# EAGLE design tricorder-sensors-mk-1.2-no-tabs (EAGLE 7.5.0)
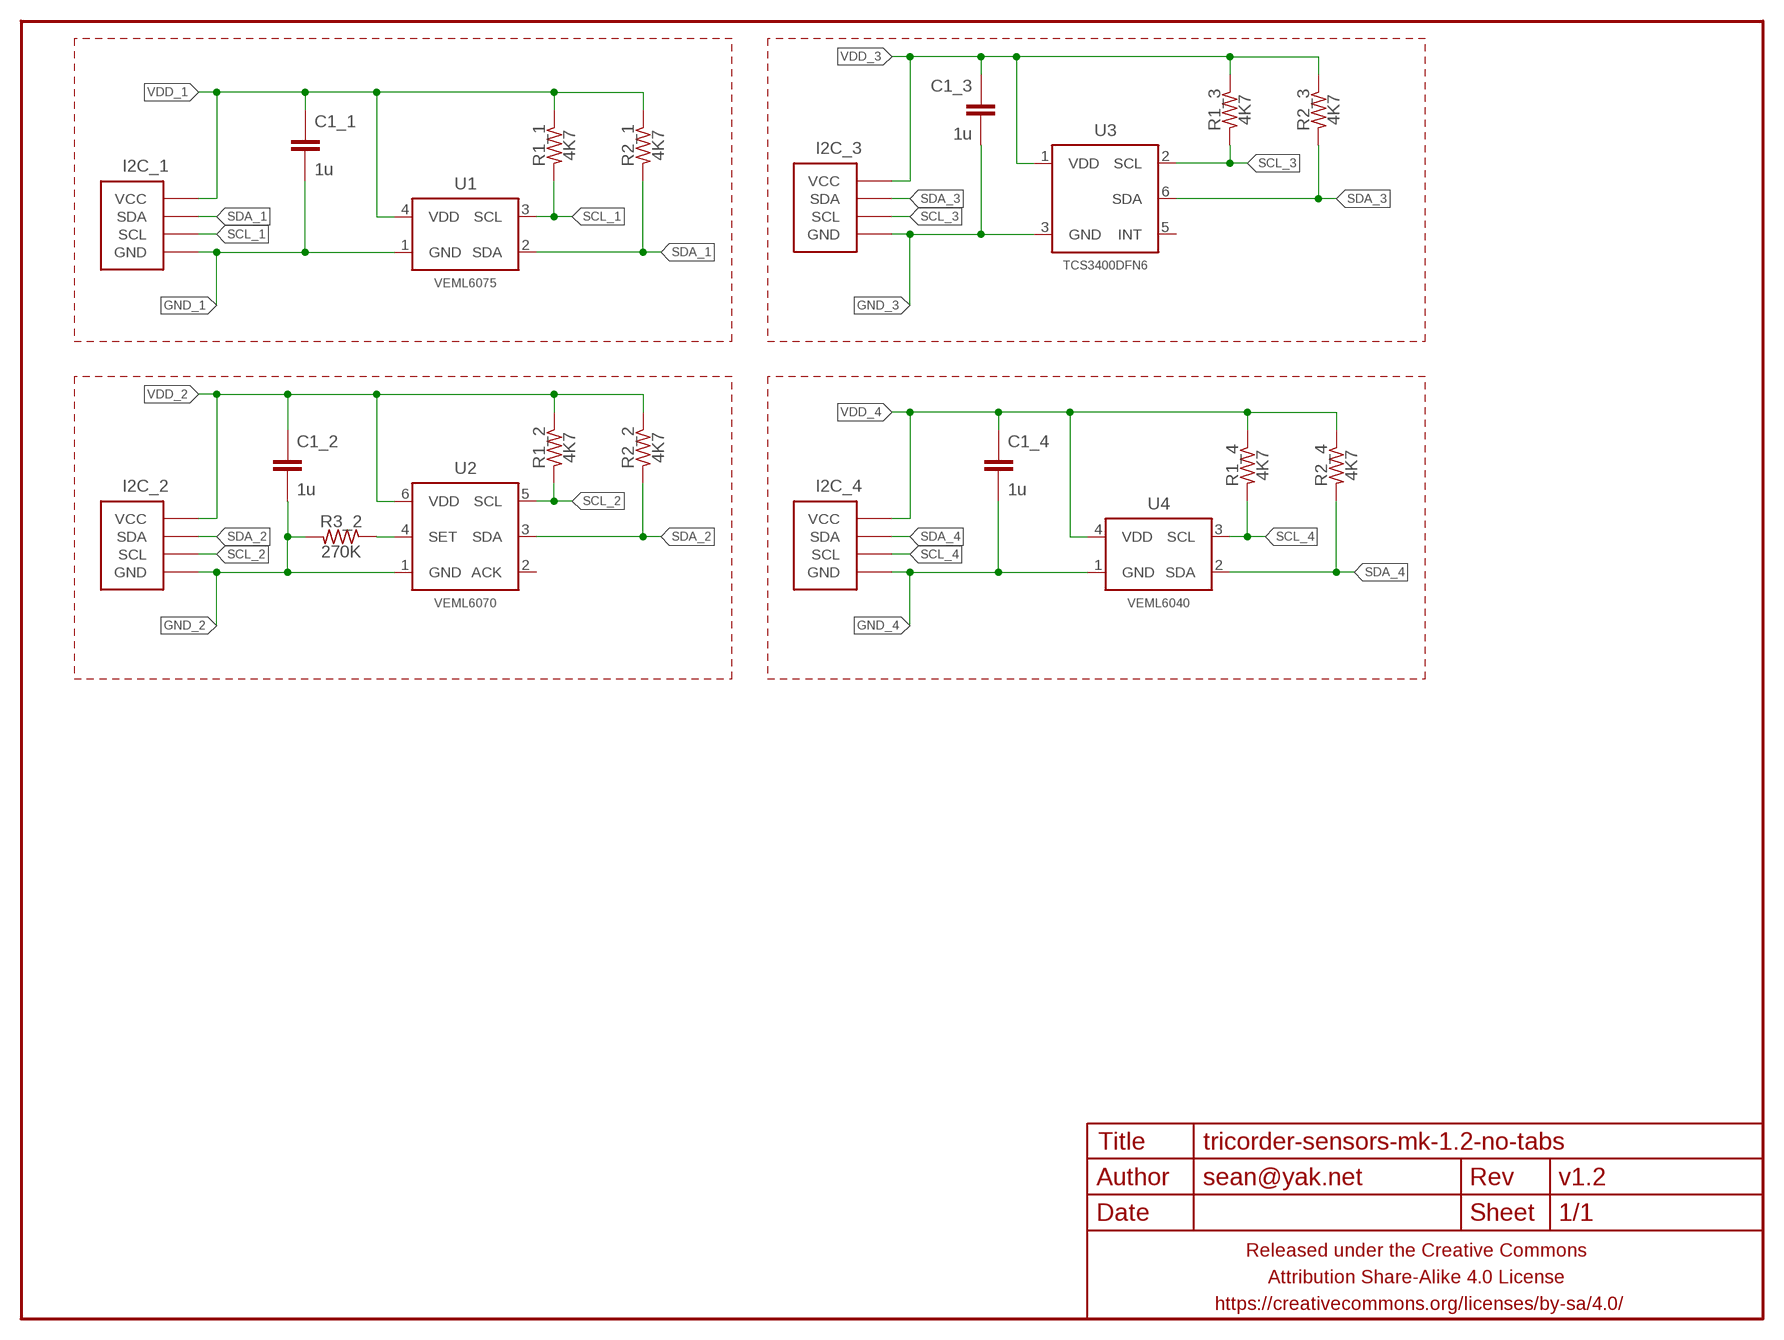
[diagram p0: schematic, sheet 1]

## Parts
C1_1  1u  CAPACITOR-CERAMICC0603  [C0603]
C1_2  1u  CAPACITOR-CERAMICC0603-TIGHTER  [C0603-TIGHTER]
C1_3  1u  CAPACITOR-CERAMICC0603  [C0603]
C1_4  1u  CAPACITOR-CERAMICC0603  [C0603]
FRAME1  FRAME-LETTERNO_PACKAGE  [DUMMY]
I2C_1  M04-I2CPTH-0.1IN-CENTERED  [1X04-PTH-VERT-I2C-CENTERED]
I2C_2  M04-I2CPTH-0.1IN-CENTERED  [1X04-PTH-VERT-I2C-CENTERED]
I2C_3  M04-I2CPTH-0.1IN-CENTERED  [1X04-PTH-VERT-I2C-CENTERED]
I2C_4  M04-I2CPTH-0.1IN-CENTERED  [1X04-PTH-VERT-I2C-CENTERED]
R1_1  4K7  RESISTORR0603  [R0603]
R1_2  4K7  RESISTORR0603-TIGHTER  [R0603-TIGHTER]
R1_3  4K7  RESISTORR0603  [R0603]
R1_4  4K7  RESISTORR0603  [R0603]
R2_1  4K7  RESISTORR0603  [R0603]
R2_2  4K7  RESISTORR0603-TIGHTER  [R0603-TIGHTER]
R2_3  4K7  RESISTORR0603  [R0603]
R2_4  4K7  RESISTORR0603  [R0603]
R3_2  270K  RESISTORR0603-TIGHTER  [R0603-TIGHTER]
U1  VEML6075  [OPLGA4]
U2  VEML6070  [OPLGA6]
U3  TCS3400DFN6  [TCS3400_DFN6]
U4  VEML6040  VEML6075  [OPLGA4]

## Nets
GND_1: C1_1.2 I2C_1.GND U1.1(GND)
GND_2: C1_2.2 I2C_2.GND R3_2.2 U2.1(GND)
GND_3: C1_3.2 I2C_3.GND U3.3(GND)
GND_4: C1_4.2 I2C_4.GND U4.1(GND)
N$1: R3_2.1 U2.4(SET)
SCL_1: I2C_1.SCL R1_1.2 U1.3(SCL)
SCL_2: I2C_2.SCL R1_2.2 U2.5(SCL)
SCL_3: I2C_3.SCL R1_3.2 U3.2(SCL)
SCL_4: I2C_4.SCL R1_4.2 U4.3(SCL)
SDA_1: I2C_1.SDA R2_1.2 U1.2(SDA)
SDA_2: I2C_2.SDA R2_2.2 U2.3(SDA)
SDA_3: I2C_3.SDA R2_3.2 U3.6(SDA)
SDA_4: I2C_4.SDA R2_4.2 U4.2(SDA)
VDD_1: C1_1.1 I2C_1.VCC R1_1.1 R2_1.1 U1.4(VDD)
VDD_2: C1_2.1 I2C_2.VCC R1_2.1 R2_2.1 U2.6(VDD)
VDD_3: C1_3.1 I2C_3.VCC R1_3.1 R2_3.1 U3.1(VDD)
VDD_4: C1_4.1 I2C_4.VCC R1_4.1 R2_4.1 U4.4(VDD)
Unconnected: U2.2(ACK) U3.5(INT)

## Library data of the parts
C1_1-C1_4 = a_parts:CAPACITOR-CERAMIC: CAPACITOR, European symbol
FRAME1 = a_parts:FRAME-LETTER: Schematic Frame Standard 8.5x11 US Letter frame; DESIGNER: sean@yak.net; VERSION: v1.2
I2C_1-I2C_4 = a_parts:M04-I2C
R1_1-R1_4 R2_1-R2_4 R3_2 = a_parts:RESISTOR: RESISTOR, American symbol
U1 U4 = a_parts:VEML6075
U2 = a_parts:VEML6070
U3 = a_parts:TCS3400

## Module SENSOR_VEML6075
Ports: 

### Library data of the parts

## Board
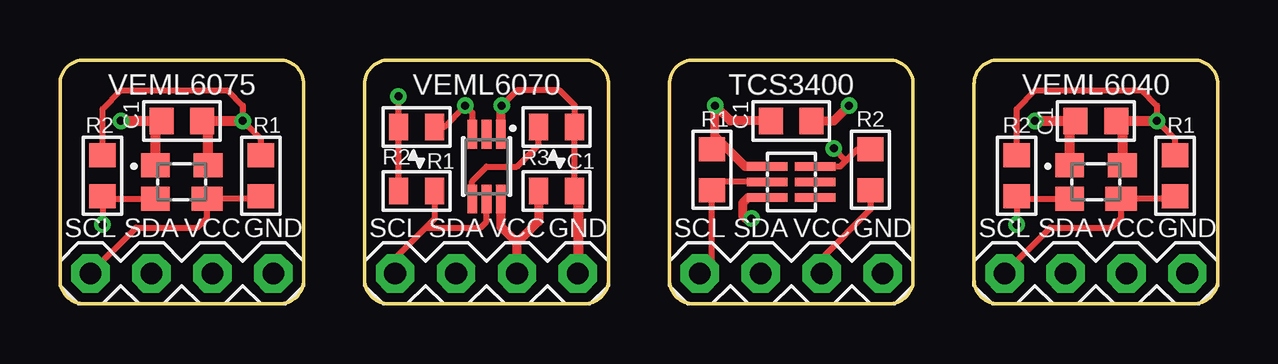
[diagram p1: board, top side]
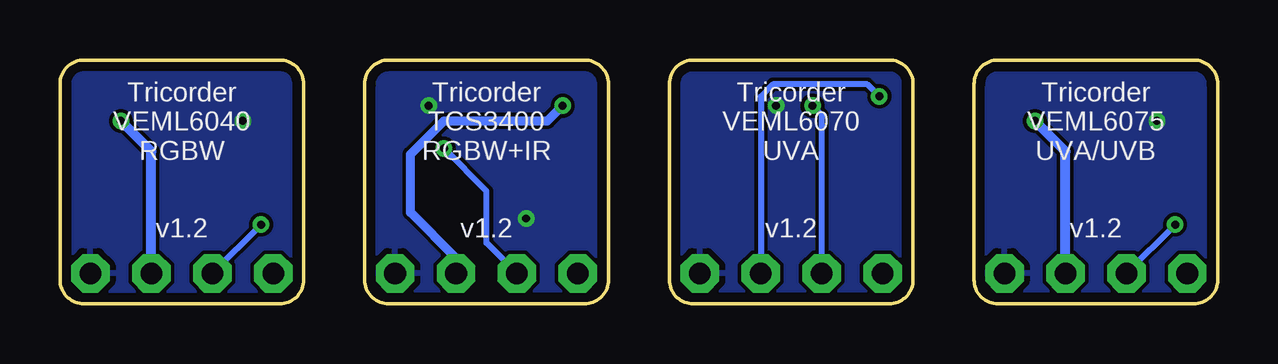
[diagram p2: board, bottom side, seen from below]

Size 48.26 x 10.16 mm. Coordinates in mm from the lower left corner, seen from the top.
Outline: 10.16,9.16 arc90 9.16,10.16 1,10.16 arc90 0,9.16 0,1 arc90 1,0 9.16,0 arc90 10.16,1 10.16,9.16
Outline: 13.7,0 21.86,0 arc90 22.86,1 22.86,9.16 arc90 21.86,10.16 13.7,10.16 arc90 12.7,9.16 12.7,1 arc90 13.7,0
Outline: 35.56,9.16 arc90 34.56,10.16 26.4,10.16 arc90 25.4,9.16 25.4,1 arc90 26.4,0 34.56,0 arc90 35.56,1 35.56,9.16
Outline: 38.1,9.16 arc-90 39.1,10.16 47.26,10.16 arc-90 48.26,9.16 48.26,1 arc-90 47.26,0 39.1,0 arc-90 38.1,1 38.1,9.16
Copper layers (1*16): Top 0.0356mm / dielectric 1.5011mm / Bottom 0.0356mm
Design rules "LaenPCBOrder2": minimum track width 6mil, minimum drill 13mil, track to track 6mil, track to pad 6mil, pad to pad 6mil, via to via 6mil, smd to smd 6mil, copper to edge 15mil, drill to drill 6mil, minimum pad ring 7mil, minimum via ring 7mil, stop-mask expansion 3mil, vias tented up to drill 20mil, thermal gap 10mil

### Footprints (pad centres in the part's own frame; a part is rotated, then mirrored left to right if it is on the bottom)
C0603 = smd 1 x 1.1: 1 -0.85,0; 2 0.85,0
C0603-TIGHTER = smd 0.8 x 1.1: 1 -0.75,0; 2 0.75,0
1X04-PTH-VERT-I2C-CENTERED = drill 0.9 pad 1.6 octagon: GND -3.81,0; SCL 3.81,0; SDA 1.27,0; VCC -1.27,0
R0603 = smd 1 x 1.1: 1 -0.85,0; 2 0.85,0
R0603-TIGHTER = smd 0.8 x 1.1: 1 -0.75,0; 2 0.75,0
OPLGA4 = smd 1.2 x 1: 1 -1.1,0.7; 2 -1.1,-0.7; 4 1.1,0.7 | smd 1.3 x 1: 3 1.05,-0.7
OPLGA6 = smd 1.2 x 0.4: 1 -1.35,0.6; 2 -1.35,0; 3 -1.35,-0.6; 4 1.35,-0.6; 5 1.35,0; 6 1.35,0.6
TCS3400_DFN6 = smd 1.7 x 0.35: 1 -1,0.65; 2 -1,0; 3 -1,-0.65; 4 1,-0.65; 5 1,0; 6 1,0.65

### Placement (x,y rotation side)
C1_1  5.08,7.62 180 top
C1_2  20.7,4.7 0 top
C1_3  30.48,7.62 0 top
C1_4  43.18,7.62 180 top
FRAME1  0,0 0 top
I2C_1  5.08,1.27 180 top
I2C_2  17.78,1.27 180 top
I2C_3  30.48,1.27 180 top
I2C_4  43.18,1.27 180 top
R1_1  8.38,5.33 270 top
R1_2  14.86,4.7 0 top
R1_3  27.18,5.59 270 top
R1_4  46.48,5.33 270 top
R2_1  1.78,5.33 270 top
R2_2  14.86,7.37 0 top
R2_3  33.78,5.59 90 top
R2_4  39.88,5.33 270 top
R3_2  20.7,7.37 0 top
U1  5.08,5.08 0 top
U2  17.78,5.71 270 top
U3  30.48,5.08 0 top
U4  43.18,5.08 0 top

### Tracks (layer width: path | path; a pad name or v marks a point on that pad's centre or on a via)
GND_1  (via drill 0.33)
  Top 0.406: U1.1 3.98,7.24 C1_1.2 v2.54,7.62
  pour Bottom: 9.16,10.16 1,10.16 arc90 0,9.16 0,1 arc90 1,0 9.16,0 arc90 10.16,1 10.16,9.16 arc90
GND_2  (via drill 0.33)
  Top 0.254: v18.41,8.26 19.05,8.89 20.83,8.89 21.45,8.27 R3_2.2 C1_2.2
  Top 0.381: U2.1 18.38,8.22 v18.41,8.26
  Top 0.406: C1_2.2 21.59,4.56 I2C_2.GND
  pour Bottom: 22.86,1 22.86,9.16 arc90 21.86,10.16 13.7,10.16 arc90 12.7,9.16 12.7,1 arc90 13.7,0 21.86,0 arc90
GND_3  (via drill 0.33)
  Top 0.381: C1_3.2 32.26,7.62 v32.89,8.26 | U3.3 28.69,4.43 28.45,4.19 28.45,3.68 28.57,3.56 v28.83,3.56
  pour Bottom: 25.4,0.89 25.4,9.16 arc-90 26.4,10.16 34.56,10.16 arc-90 35.56,9.16 35.56,0.99 arc-89 34.57,-0.01 26.41,-0.11 arc-91
GND_4  (via drill 0.33)
  Top 0.406: U4.1 42.08,7.37 C1_4.2 v40.64,7.62
  pour Bottom: 47.26,10.16 39.1,10.16 arc90 38.1,9.16 38.1,1 arc90 39.1,0 47.26,0 arc90 48.26,1 48.26,9.16 arc90
N$1
  Top 0.254: U2.4 17.18,5.12 17.78,5.71 19.05,5.71 19.95,6.62 R3_2.1
SCL_1
  Top 0.254: I2C_1.SCL 3.17,3.17 5.71,3.17 6.13,3.59 U1.3 8.28,4.38 R1_1.2
SCL_2
  Top 0.254: I2C_2.SCL 13.97,1.91 15.24,3.17 | 15.24,3.17 17.53,3.17 17.78,3.43 U2.5 | R1_2.2 15.61,3.54 15.24,3.17
SCL_3
  Top 0.254: I2C_3.SCL 27.18,1.78 R1_3.2 27.52,5.08 U3.2
SCL_4
  Top 0.254: I2C_4.SCL 41.27,3.17 43.81,3.17 44.23,3.59 U4.3 46.38,4.38 R1_4.2
SDA_1  (via drill 0.33)
  Top 0.254: v1.78,3.3 R2_1.2 1.88,4.38 U1.2
  Bottom 0.254: v1.78,3.3 I2C_1.SDA
SDA_2  (via drill 0.33)
  Top 0.254: U2.3 17.18,7.97 v16.89,8.26 16,7.37 R2_2.2
  Bottom 0.254: I2C_2.SDA 16.51,7.87 v16.89,8.26
SDA_3  (via drill 0.33)
  Top 0.254: v32.26,6.48 32.77,5.97 | R2_3.2 33.23,6.44 32.77,5.97 | U3.6 32.53,5.73 32.77,5.97
  Bottom 0.254: I2C_3.SDA 30.48,2.54 30.48,4.7 v32.26,6.48
SDA_4  (via drill 0.33)
  Top 0.254: v39.88,3.3 R2_4.2 39.98,4.38 U4.2
  Bottom 0.254: v39.88,3.3 I2C_4.SDA
VDD_1  (via drill 0.33)
  Top 0.254: R1_1.1 8.38,6.86 v7.62,7.62 7.62,8.26 6.99,8.89 2.54,8.89 1.78,8.13 R2_1.1
  Top 0.406: v7.62,7.62 C1_1.1 6.18,7.24 U1.4
  Bottom 0.406: I2C_1.VCC 6.35,6.35 v7.62,7.62
VDD_2  (via drill 0.33)
  Top 0.254: v14.11,8.65 R2_2.1 R1_2.1
  Top 0.381: I2C_2.VCC 19.05,2.54 | 19.05,2.54 18.38,3.21 U2.6 | C1_2.1 19.95,3.44 19.05,2.54
  Bottom 0.254: I2C_2.VCC 19.05,8.64 18.54,9.14 14.61,9.14 v14.11,8.65
VDD_3  (via drill 0.33)
  Top 0.254: R2_3.1 33.78,3.94 31.75,1.91 I2C_3.VCC
  Top 0.381: U3.1 28.56,5.73 27.3,6.99 | R1_3.1 27.3,6.57 27.3,6.99 | 27.3,6.99 v27.3,8.26 27.94,7.62 C1_3.1
  Bottom 0.381: I2C_3.VCC 31.75,1.91 33.66,3.81 33.66,6.22 32.26,7.62 27.94,7.62 v27.3,8.26
VDD_4  (via drill 0.33)
  Top 0.254: R2_4.1 39.88,8.13 40.64,8.89 45.09,8.89 45.72,8.26 v45.72,7.62 46.48,6.86 R1_4.1
  Top 0.406: v45.72,7.62 C1_4.1 44.28,7.37 U4.4
  Bottom 0.406: I2C_4.VCC 44.45,6.35 v45.72,7.62

### Text on the board
tPlace: VEML6075 | VEML6070 | TCS3400 | VEML6040
bPlace: Tricorder / VEML6075 / UVA/UVB | Tricorder / VEML6070 / UVA | Tricorder / TCS3400 / RGBW+IR | Tricorder / VEML6040 / RGBW
tNames: C1 | C1 | C1 | R2 | R1 | R1 | R2 | R2 | R1 | R2 | R1 | R3 | C1